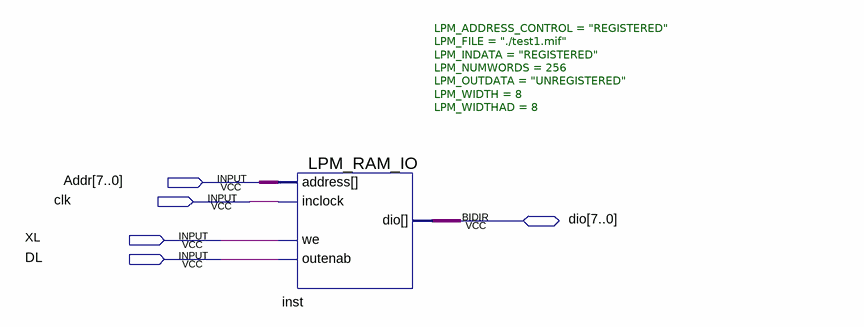
[diagram p0: schematic sheet]
// Quartus schematic RAM_IO.bdf as structural Verilog: 1 symbols, 5 pins
module RAM_IO (
  input  [7:0] Addr,
  input  clk,
  input  XL,
  input  DL,
  inout  [7:0] dio
);

  LPM_RAM_IO #(.LPM_ADDRESS_CONTROL("REGISTERED"), .LPM_FILE("./test1.mif"), .LPM_INDATA("REGISTERED"), .LPM_NUMWORDS(256), .LPM_OUTDATA("UNREGISTERED"), .LPM_WIDTH(8), .LPM_WIDTHAD(8)) inst (
    .address(Addr), .inclock(clk), .we(XL), .outenab(DL), .dio(dio));
endmodule
